# EAGLE design LineSense (EAGLE 9.6.2)

## Sheet 1 of 2
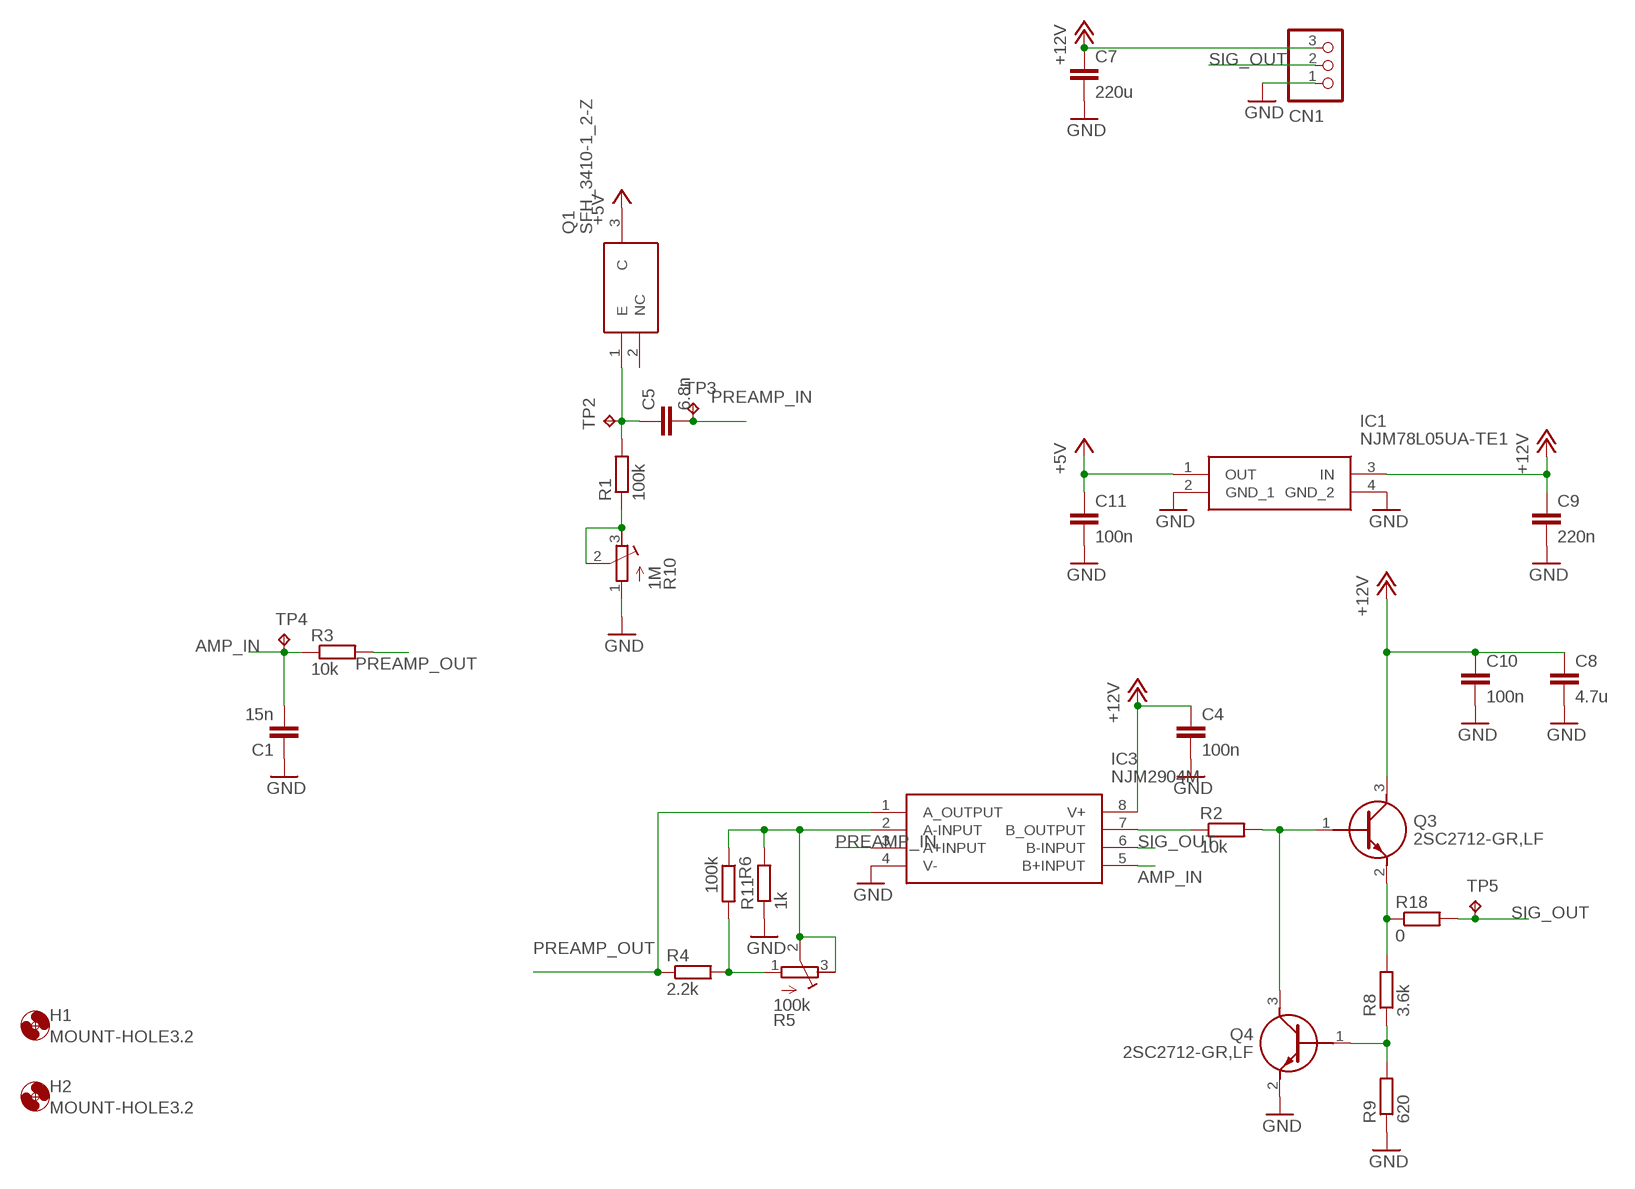
[diagram p0: schematic, sheet 1]

### Parts
C1  15n  C-EUC0603  [C0603]
C4  100n  C-EUC0603  [C0603]
C5  6.8n  C-EUC0603  [C0603]
C7  220u  C-EU025-025X050  [C025-025X050]
C8  4.7u  C-EUC1210  [C1210]
C9  220n  C-EUC0603  [C0603]
C10  100n  C-EUC0603  [C0603]
C11  100n  C-EUC0603  [C0603]
CN1  S3B-XH-A  [S3B-XH-A]
H1  MOUNT-HOLE3.2  [3,2]
H2  MOUNT-HOLE3.2  [3,2]
IC1  NJM78L05UA-TE1  [SOT-89-3]
IC3  NJM2904M  [SOIC127P680X200-8N]
Q1  SFH_3410-1_2-Z  [SFH341012Z]
Q3  2SC2712-GR,LF  [SSM3J334RLF]
Q4  2SC2712-GR,LF  [SSM3J334RLF]
R1  100k  R-EU_R0603  [R0603]
R2  10k  R-EU_R0603  [R0603]
R3  10k  R-EU_R0603  [R0603]
R4  2.2k  R-EU_R0603  [R0603]
R5  100k  R-TRIMM3339P  [RTRIM3339P]
R6  100k  R-EU_R0603  [R0603]
R8  3.6k  R-EU_R0603  [R0603]
R9  620  R-EU_R0603  [R0603]
R10  1M  R-TRIMM3339P  [RTRIM3339P]
R11  1k  R-EU_R0603  [R0603]
R18  0  R-EU_R0603  [R0603]
TP2  TPB1,27  [B1,27]
TP3  TPB1,27  [B1,27]
TP4  TPB1,27  [B1,27]
TP5  TPB1,27  [B1,27]

### Nets
+5V: C11.1 IC1.1(OUT) Q1.3(C)
+12V: C4.1 C7.1 C8.1 C9.1 C10.1 CN1.3 IC1.3(IN) IC3.8(V+) Q3.3(C) ; also sheet 2
AMP_IN: C1.2 IC3.5(B+INPUT) R3.1 TP4.TP
GND: C1.1 C4.2 C7.2 C8.2 C9.2 C10.2 C11.2 CN1.1 IC1.2(GND_1) IC1.4(GND_2) IC3.4(V-) Q4.2(E) R9.1 R10.1(A) R11.1 ; also sheet 2
N$1: R1.1 R10.2(S) R10.3(E)
N$2: Q3.2(E) R8.2 R18.1
N$4: C5.1 Q1.1(E) R1.2 TP2.TP
N$5: R4.2 R5.1(A) R6.2
N$6: IC3.2(A-INPUT) R5.2(S) R5.3(E) R6.1 R11.2
N$7: IC3.7(B_OUTPUT) R2.1
N$8: Q3.1(B) Q4.3(C) R2.2
N$10: Q4.1(B) R8.1 R9.2
PREAMP_IN: C5.2 IC3.3(A+INPUT) TP3.TP
PREAMP_OUT: IC3.1(A_OUTPUT) R3.2 R4.1
SIG_OUT: CN1.2 IC3.6(B-INPUT) R18.2 TP5.TP
Unconnected: Q1.2(NC)

## Sheet 2 of 2
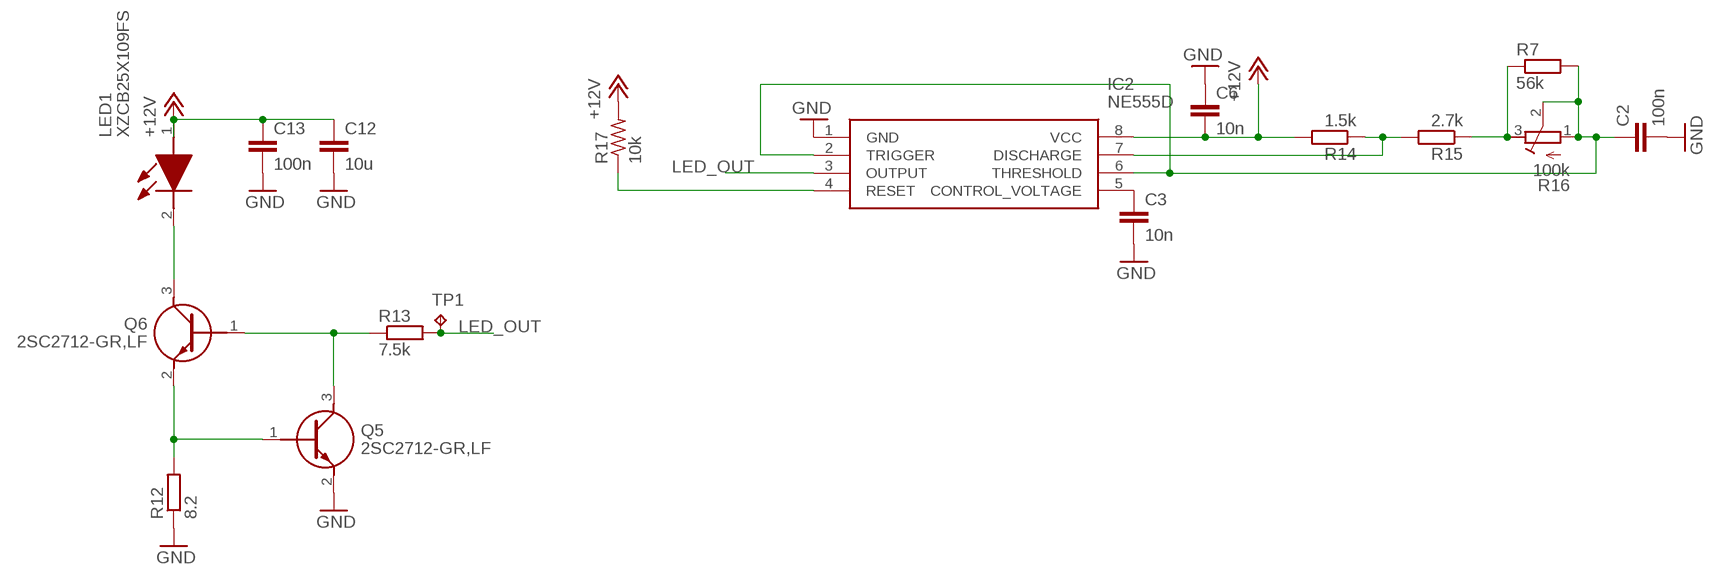
[diagram p1: schematic, sheet 2]

### Parts
C2  100n  C-EUC0603  [C0603]
C3  10n  C-EUC0603  [C0603]
C6  10n  C-EUC0603  [C0603]
C12  10u  C-EUC1210  [C1210]
C13  100n  C-EUC0603  [C0603]
IC2  NE555D  [SOIC127P600X200-8N]
LED1  XZCB25X109FS  [XZCB25X109FS]
Q5  2SC2712-GR,LF  [SSM3J334RLF]
Q6  2SC2712-GR,LF  [SSM3J334RLF]
R7  56k  R-EU_R0603  [R0603]
R12  8.2  R-EU_R0603  [R0603]
R13  7.5k  R-EU_R0603  [R0603]
R14  1.5k  R-EU_R0603  [R0603]
R15  2.7k  R-EU_R0603  [R0603]
R16  100k  R-TRIMM3339P  [RTRIM3339P]
R17  10k  R-US_R0603  [R0603]
TP1  TPB1,27  [B1,27]

### Nets
+12V: C6.2 C12.1 C13.1 IC2.8(VCC) LED1.1(A) R14.2 R17.2 ; also sheet 1
GND: C2.2 C3.2 C6.1 C12.2 C13.2 IC2.1(GND) Q5.2(E) R12.1 ; also sheet 1
LED_OUT: IC2.3(OUTPUT) R13.2 TP1.TP
N$11: LED1.2(K) Q6.3(C)
N$12: Q5.1(B) Q6.2(E) R12.2
N$13: Q5.3(C) Q6.1(B) R13.1
N$15: C3.1 IC2.5(CONTROL_VOLTAGE)
N$16: IC2.4(RESET) R17.1
N$17: C2.1 IC2.2(TRIGGER) IC2.6(THRESHOLD) R7.2 R16.1(A) R16.2(S)
N$18: IC2.7(DISCHARGE) R14.1 R15.2
N$19: R7.1 R15.1 R16.3(E)

## Library data of the parts
C1-C13 = rcl:C-EU: CAPACITOR, European symbol; SPICEPREFIX: C
CN1 = jst-xh:S3B-XH-A: Wire-to-Board 2.5mm pitch side mount connector Source: http://www.jst-mfg.com/product/pdf/jpn/XH.pdf http://www.jst-mfg.com/product/detail.php?series=277
H1 H2 = holes:MOUNT-HOLE: MOUNTING HOLE with drill center marker
IC1 = SamacSys_Parts:NJM78L05UA-TE1: Standard Regulator Pos 5V 0.1A New Japan Radio NJM78Lxx NJM78L05UA-TE1, Single Linear Voltage Regulator, 100mA 5 V, 3-Pin SOT-89 Source: Datasheet <http://uk.rs-online.com/web/p/products/7139502>; DESCRIPTION: Standard Regulator Pos 5V 0.1A New Japan Radio NJM78Lxx NJM78L05UA-TE1, Single Linear Voltage Regulator, 100mA 5 V, 3-Pin SOT-89; HEIGHT: mm; MANUFACTURER_NAME: New Japan Radio; MANUFACTURER_PART_NUMBER: NJM78L05UA-TE1; MOUSER_PART_NUMBER: 513-NJM78L05UA-TE1; MOUSER_PRICE-STOCK: https://www.mouser.co.uk/ProductDetail/NJR/NJM78L05UA-TE1?qs=7Wjyd1RpqPrEwMC6ffZWiw%3D%3D
IC2 = SamacSys_Parts:NE555D: Timers & Support Products Single Timer Source: Datasheet <https://4donline.ihs.com/images/VipMasterIC/IC/FAIR/FAIRS20025/FAIRS20025-1.pdf?hkey=52A5661711E402568146F3353EA87419>; ARROW_PART_NUMBER: NE555D; DESCRIPTION: Timers & Support Products Single Timer; HEIGHT: 2mm; MANUFACTURER_NAME: onsemi; MANUFACTURER_PART_NUMBER: NE555D; MOUSER_PART_NUMBER: 512-NE555D; MOUSER_PRICE-STOCK: https://www.mouser.co.uk/ProductDetail/onsemi-Fairchild/NE555D?qs=k2x4EL1%2FKj7KkGpSqdv4Lg%3D%3D
IC3 = SamacSys_Parts:NJM2904M: IC OPAMP GP 600KHZ 8DMP Source: Datasheet <https://datasheet.datasheetarchive.com/originals/distributors/Datasheets-16/DSA-316368.pdf>; DESCRIPTION: IC OPAMP GP 600KHZ 8DMP; HEIGHT: 2mm; MANUFACTURER_NAME: New Japan Radio; MANUFACTURER_PART_NUMBER: NJM2904M; MOUSER_PART_NUMBER: 513-NJM2904M; MOUSER_PRICE-STOCK: https://www.mouser.co.uk/ProductDetail/NJR/NJM2904M?qs=HYyrw03vwLEPq1p%252B8%2FBLbA%3D%3D
LED1 = SamacSys_Parts:XZCB25X109FS: 3.5x2.8 mm SMD CHIP LED LAMP Source: Datasheet <http://www.sunledusa.com/products/spec/XZCB25X109FS.pdf>; DESCRIPTION: 3.5x2.8 mm SMD CHIP LED LAMP; HEIGHT: 0.8mm; MANUFACTURER_NAME: SunLED; MANUFACTURER_PART_NUMBER: XZCB25X109FS
Q1 = original:SFH_3410-1_2-Z: Phototransistors 570nm Top View 3-SMD, Gull Wing Source: Datasheet <https://dammedia.osram.info/media/resource/hires/osram-dam-6674191/SFH 3410_EN.pdf>; ARROW_PART_NUMBER: SFH 3410-1/2-Z; ARROW_PRICE-STOCK: https://www.arrow.com/en/products/sfh-3410-12-z/ams-osram?region=nac; DESCRIPTION: Phototransistors 570nm Top View 3-SMD, Gull Wing; HEIGHT: 1.15mm; MANUFACTURER_NAME: AMS OSRAM GROUP; MANUFACTURER_PART_NUMBER: SFH 3410-1/2-Z; MOUSER_PART_NUMBER: 720-SFH3410-1/2-Z; MOUSER_PRICE-STOCK: https://www.mouser.co.uk/ProductDetail/ams-OSRAM/SFH-3410-1-2-Z?qs=KeLXQb9Uup2%252BjTYJixiTQA%3D%3D
Q3-Q6 = SamacSys_Parts:2SC2712-GR,LF: Bipolar Transistors - BJT Transistor Lo Freq 0.15A 50V Source: Datasheet <http://toshiba.semicon-storage.com/info/docget.jsp?did=19227&prodName=2SC2712>; ARROW_PART_NUMBER: 2SC2712-GR,LF; ARROW_PRICE-STOCK: https://www.arrow.com/en/products/2sc2712-grlf/toshiba?region=nac; DESCRIPTION: Bipolar Transistors - BJT Transistor Lo Freq 0.15A 50V; HEIGHT: 0.88mm; MANUFACTURER_NAME: Toshiba; MANUFACTURER_PART_NUMBER: 2SC2712-GR,LF; MOUSER_PART_NUMBER: 757-2SC2712-GRLF; MOUSER_PRICE-STOCK: https://www.mouser.co.uk/ProductDetail/Toshiba/2SC2712-GRLF?qs=OLJpxlzHOSROHaH%2Fh9sb9g%3D%3D
R1-R4 R6-R9 R11-R15 R18 = rcl:R-EU_: RESISTOR, European symbol; SPICEPREFIX: R
R5 R10 R16 = rcl:R-TRIMM: Trimm resistor; SPICEMODEL: X; SPICEPREFIXL: POT
R17 = rcl:R-US_: RESISTOR, American symbol; SPICEPREFIX: R
TP1-TP5 = testpad:TP: Test pad

## Board
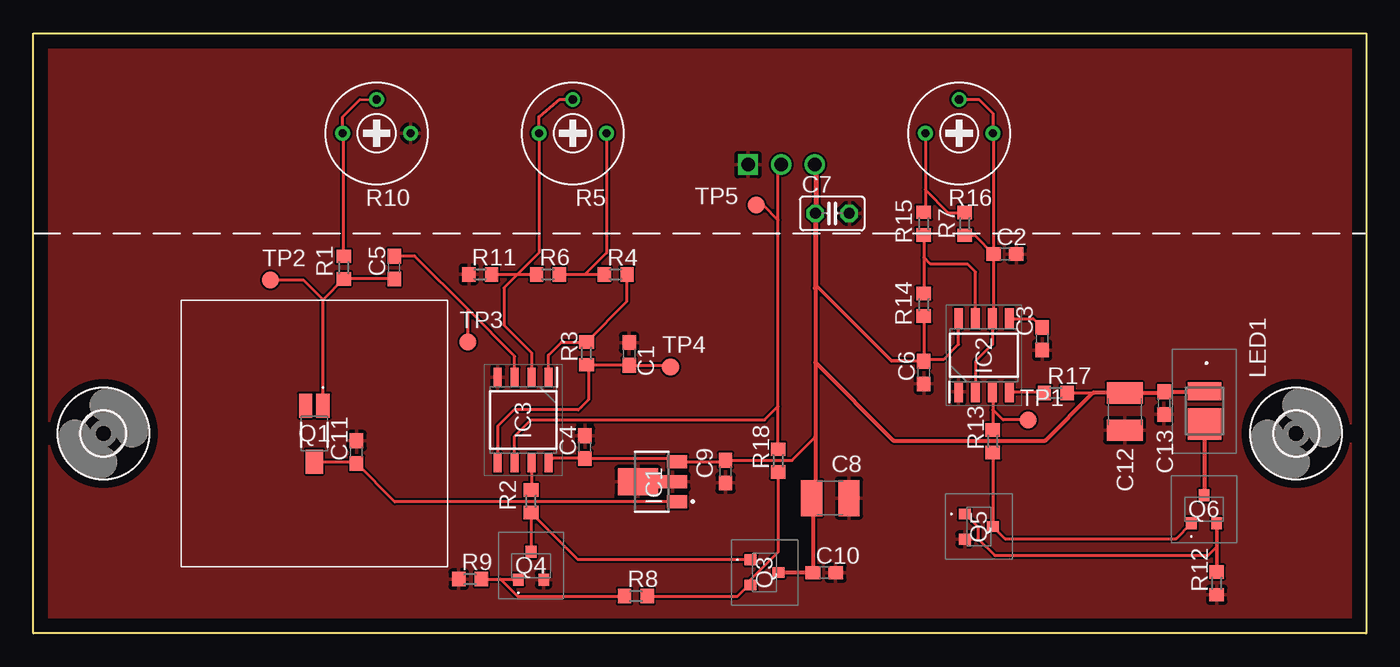
[diagram p2: board, top side]
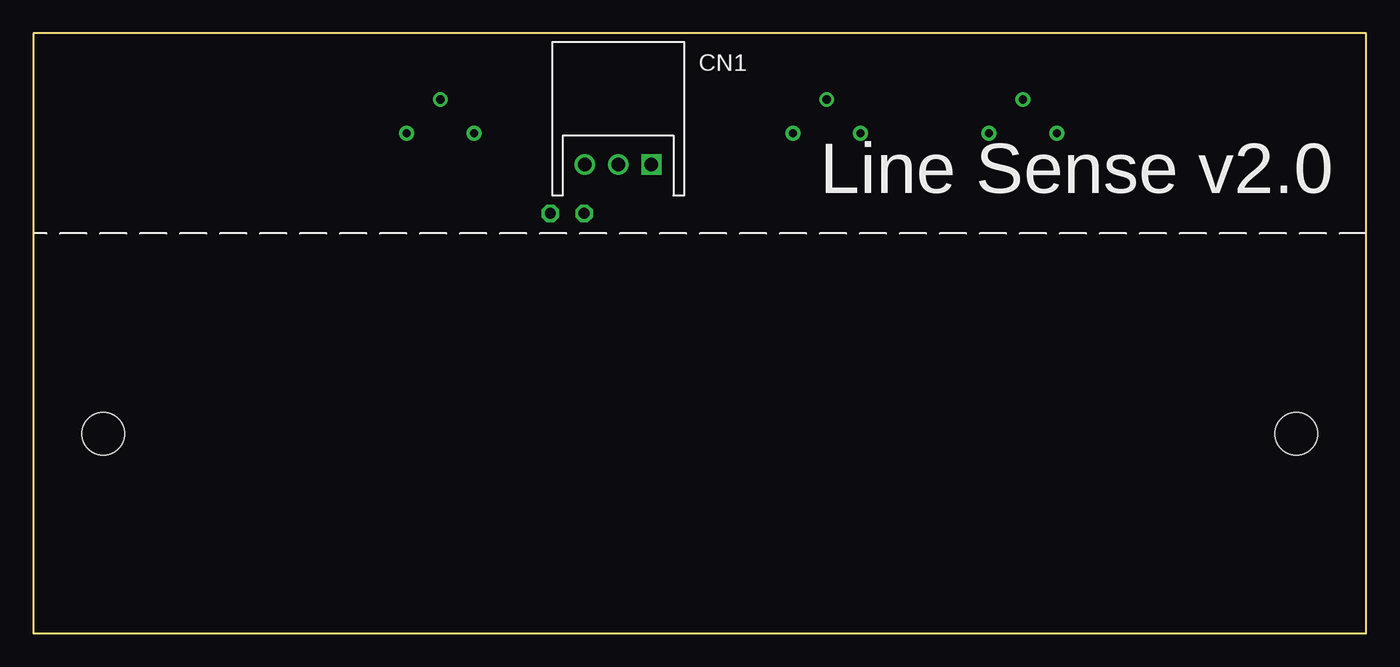
[diagram p3: board, bottom side, seen from below]

Size 100 x 45 mm. Coordinates in mm from the lower left corner, seen from the top.
Outline: 0,0 0,45 100,45 100,0 0,0
Copper layers (1*16): Top 0.035mm / dielectric 1.5mm / Bottom 0.035mm
Design rules "default": minimum track width 6mil, minimum drill 0.35mm, track to track 6mil, track to pad 6mil, pad to pad 6mil, via to via 6mil, smd to smd 6mil, copper to edge 40mil, drill to drill 6mil, minimum pad ring 10mil, minimum via ring 8mil, stop-mask expansion 4mil, vias tented up to drill 0mil, thermal gap 10mil

### Footprints (pad centres in the part's own frame; a part is rotated, then mirrored left to right if it is on the bottom)
C0603 = smd 1.1 x 1: 1 -0.85,0; 2 0.85,0
C025-025X050 = drill 0.813 octagon: 1 -1.27,0; 2 1.27,0
C1210 = smd 1.6 x 2.7: 1 -1.4,0; 2 1.4,0
S3B-XH-A = drill 1.016 square: 1 2.5,0 | drill 1.016: 2 0,0; 3 -2.5,0
3,2 = hole 3.2: 0,0
SOT-89-3 = smd 1 x 1.5: 1 -1.5,-1.65; 3 1.5,-1.65 | smd 1 x 2.2: 2 0,-1.3 | smd 2 x 3: 4 0,1.3
SOIC127P600X200-8N = smd 1.55 x 0.65: 1 -2.75,1.905; 2 -2.75,0.635; 3 -2.75,-0.635; 4 -2.75,-1.905; 5 2.75,-1.905; 6 2.75,-0.635; 7 2.75,0.635; 8 2.75,1.905
SOIC127P680X200-8N = smd 1.425 x 0.6: 1 -3.212,1.905; 2 -3.212,0.635; 3 -3.212,-0.635; 4 -3.212,-1.905; 5 3.212,-1.905; 6 3.212,-0.635; 7 3.212,0.635; 8 3.212,1.905
XZCB25X109FS = smd 1.35 x 2.5: 1 -1.475,0 | smd 2.35 x 2.5: 2 0.975,0
SFH341012Z = smd 1 x 1.8: 1 -0.65,-2.1; 2 0.65,-2.1 | smd 1.3 x 1.8: 3 0,2.1
SSM3J334RLF = smd 0.8 x 0.9: 1 -0.95,-1.05; 2 0.95,-1.05; 3 0,1.05
R0603 = smd 1 x 1.1: 1 -0.85,0; 2 0.85,0
RTRIM3339P = drill 0.61: 1 -2.54,0; 2 0,-2.54; 3 2.54,0
B1,27 = smd 1.27 x 1.27: TP 0,0

### Placement (x,y rotation side)
C1  44.7,20.95 270 top
C2  72.9,28.45 0 top
C3  75.69,22.1 270 top
C4  41.39,13.97 90 top
C5  27.08,27.43 90 top
C6  66.8,19.56 90 top
C7  59.94,31.5 0 top
C8  59.79,10.15 0 top
C9  51.93,12.13 270 top
C10  59.35,4.55 0 top
C11  24.24,13.59 90 top
C12  81.89,16.63 270 top
C13  84.84,17.27 270 top
CN1  56.12,35.15 0 bottom
H1  5.26,14.99 0 top
H2  94.74,14.99 0 top
IC1  46.65,11.36 90 top
IC2  71.32,20.86 90 top
IC3  36.75,16 270 top
LED1  87.87,16.66 270 top
Q1  21.08,14.99 180 top
Q3  54.86,4.57 270 top
Q4  37.34,5.08 0 top
Q5  70.94,8 270 top
Q6  87.84,9.31 0 top
R1  23.29,27.43 270 top
R2  37.34,9.91 270 top
R3  41.5,21 90 top
R4  43.69,26.92 180 top
R5  40.47,37.5 180 top
R6  38.61,26.92 0 top
R7  69.89,30.71 270 top
R8  45.21,2.79 0 top
R9  32.77,4.06 0 top
R10  25.76,37.5 180 top
R11  33.53,26.92 0 top
R12  88.79,3.75 90 top
R13  71.99,14.4 90 top
R14  66.8,24.64 270 top
R15  66.8,30.73 270 top
R16  69.46,37.5 180 top
R17  76.71,18.03 0 top
R18  55.88,12.95 90 top
TP1  74.64,16 0 top
TP2  17.8,26.49 0 top
TP3  32.61,21.84 0 top
TP4  47.81,19.99 0 top
TP5  54.25,32.13 0 top

### Tracks (layer width: path | path; a pad name or v marks a point on that pad's centre or on a via)
+5V
  Top 0.152: 24.1,12.89 C11.1
  Top 0.229: Q1.3 24.1,12.89 | IC1.1 27.12,9.86 C11.1
+12V
  Top 0.229: IC2.8 69.42,21.66 68.33,20.57 66.97,20.57 | 65.41,20.45 65.44,20.41 C6.2 R14.2 | IC3.8 38.99,13.12 C4.1 48.04,13.12 IC1.3 51.81,12.86 C9.1 56.92,12.98 58.67,14.73 | R17.2 79.5,18.03
  Top 0.254: C6.2 66.97,20.57 | 65.41,20.45 64.39,20.45 58.67,26.16
  Top 0.305: 58.67,26.16 58.67,25.91 58.67,20.32 | Q3.3 55.94,4.55 C10.1 58.5,10.04 C8.1 58.67,10.43 58.67,14.73 58.67,20.32 | 58.67,20.32 64.55,14.45 75.92,14.45 79.5,18.03 79.51,18.03 C12.1 84.74,18.03 C13.1 87.85,18.12 LED1.1
  Top 0.381: 58.67,25.91 C7.1 58.72,31.54 58.72,35.06 CN1.3
AMP_IN
  Top 0.229: TP4.TP 47.69,20.11 C1.2 44.66,20.15 R3.1 41.66,19.99 41.66,17.53 40.89,16.76 36.07,16.76 34.84,15.54 IC3.5
GND
  pour Top: 1,44 1,1 99,1 99,44
LED_OUT
  Top 0.229: IC2.3 71.99,18.08 71.99,16.76 | 71.99,16.76 R13.2 | TP1.TP 72.75,16 71.99,16.76
N$1
  Top 0.229: R1.1 23.29,37.41 R10.3 23.22,38.76 24.49,40.03 R10.2
N$2
  Top 0.229: R18.1 55.88,6.1 53.81,4.03 Q3.2 53.66,3.62 52.83,2.79 R8.2
N$4
  Top 0.229: Q1.1 21.73,25.02 | 21.73,25.02 20.26,26.49 TP2.TP | 21.73,25.02 R1.2 C5.1
N$5
  Top 0.229: R6.2 41.4,26.92 | 41.4,26.92 R4.2 | R5.1 43.01,28.53 41.4,26.92
N$6
  Top 0.229: R11.2 36.32,26.92 | 36.32,26.92 R6.1 | 36.32,26.92 37.93,28.53 R5.3 37.93,38.75 39.47,40.04 R5.2 | 36.32,26.92 35.31,25.91 35.31,23.11 37.38,21.04 IC3.2
N$7
  Top 0.229: IC3.7 37.38,10.8 R2.1
N$8
  Top 0.229: Q4.3 R2.2 40.87,5.52 Q3.1
N$10
  Top 0.229: R9.2 35.05,4.06 | 35.05,4.06 36.35,4.06 Q4.1 | 35.05,4.06 36.32,2.79 R8.1
N$11
  Top 0.305: LED1.2 87.87,10.39 Q6.3
N$12
  Top 0.229: Q5.1 70.87,7.98 70.87,7.11 72.14,5.84 88.14,5.84 88.79,6.49 Q6.2
  Top 0.254: Q6.2 R12.2
N$13
  Top 0.229: R13.1 Q5.3 72.88,7.11 85.74,7.11 Q6.1
N$15
  Top 0.229: IC2.5 75.03,23.61 C3.1
N$16
  Top 0.229: IC2.4 75.78,18.11 R17.1
N$17
  Top 0.229: C2.1 72.05,23.7 IC2.6 71.96,21.66 70.69,20.39 IC2.2 | C2.1 72.05,36.79 R16.1 72,39 70.96,40.04 R16.2 | R7.2 70.64,29.86 C2.1
N$18
  Top 0.229: R15.2 66.8,28.19 | 66.8,28.19 R14.1 | IC2.7 70.69,27.1 70.1,27.69 67.31,27.69 66.8,28.19
N$19
  Top 0.229: R16.3 66.92,33.27 | 66.92,33.27 66.92,31.7 R15.1 | 66.92,33.27 68.64,31.56 R7.1
PREAMP_IN
  Top 0.229: IC3.3 36.12,20.78 32.64,24.26 | C5.2 28.61,28.28 32.64,24.26 | TP3.TP 32.61,24.23 32.64,24.26
PREAMP_OUT
  Top 0.229: IC3.1 38.66,20.88 39.63,21.85 R3.2 44.54,24.89 R4.1
SIG_OUT
  Top 0.229: R18.2 55.88,17.02 | 55.88,17.02 55.88,30.99 | 55.88,30.99 55.88,34.91 CN1.2 | TP5.TP 54.73,32.13 55.88,30.99 | IC3.6 36.12,14.78 37.34,16 54.86,16 55.88,17.02

### Text on the board
bNames: Line Sense v2.0